# Altium schematic sheet Bluetooth.SchDoc
size A4
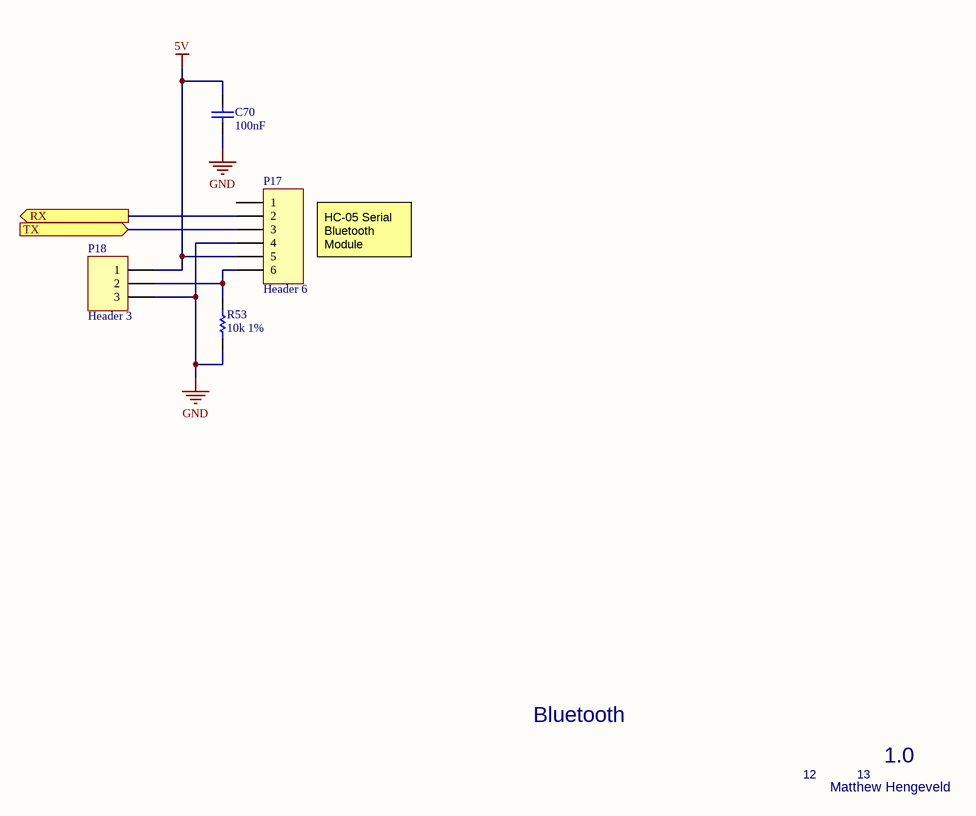
[diagram p0: Bluetooth.SchDoc]

## Parts
C70  100nF  [CAPC1608X92X38LL15T08]
P17  Header 6  [HDR1X6]
P18  Header 3  [HDR1X3]
R53  10k 1%  [RESC1608X55X30LL15T15]

## Ports
RX (out), TX (in)

## Nets
5V: C70.1 P17.5 P18.1
GND: C70.2 P17.4 P18.3 R53.1
RX: P17.2 ; port RX
TX: P17.3 ; port TX
NetP17_6: P17.6 P18.2 R53.2

Not connected (* = marked no-connect by the designer): P17 1

## Notes on the sheet
- HC-05 Serial Bluetooth Module
- Bluetooth
- 12
- 13
- 1.0
- Matthew Hengeveld

## Library data of the parts
C70 = CMP-2006-01974-1: Part Number: VJ0603Y104KNXAO; Manufacturer: Vitramon
P17 = Header 6: Header, 6-Pin; LatestRevisionDate: 17-Jul-2002; LatestRevisionNote: Re-released for DXP Platform.; Publisher: Altium Limited
P18 = Header 3: Header, 3-Pin; LatestRevisionDate: 17-Jul-2002; LatestRevisionNote: Re-released for DXP Platform.; Publisher: Altium Limited
R53 = CMP-2000-00181-1: Part Number: ERJ-3EKF1002V; Manufacturer: Panasonic